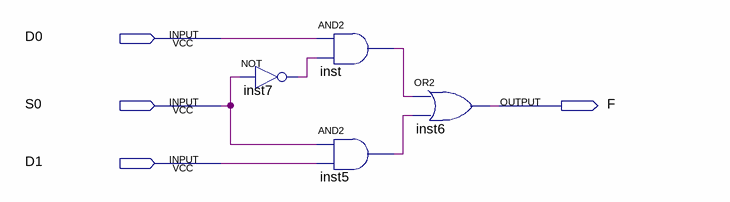
[diagram p0: schematic sheet]
// Quartus schematic 2x1Mux.bdf as structural Verilog: 4 symbols, 4 pins
module \2x1Mux  (
  input  D0,
  input  S0,
  input  D1,
  output F
);

  wire inst5_out, inst7_out, inst_out;

  not inst7 (inst7_out, S0);
  and inst (inst_out, D0, inst7_out);
  and inst5 (inst5_out, S0, D1);
  or inst6 (F, inst_out, inst5_out);
endmodule
